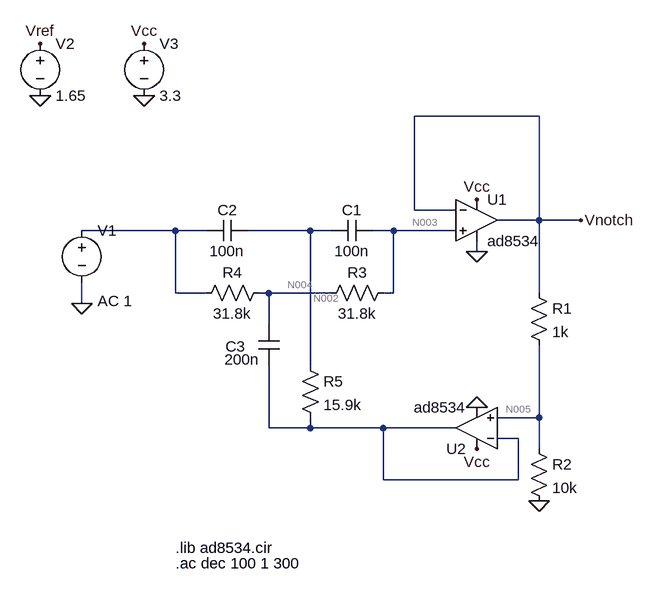
[diagram p0: schematic Draft1.asc]
Draft1.asc, the LTspice schematic file:
Version 4.1
SHEET 1 880 680
WIRE 512 -64 320 -64
WIRE 320 80 320 -64
WIRE 384 80 320 80
WIRE 512 96 512 -64
WIRE 512 96 448 96
WIRE 576 96 512 96
WIRE -48 112 -192 112
WIRE 0 112 -48 112
WIRE 160 112 64 112
WIRE 192 112 160 112
WIRE 288 112 256 112
WIRE 384 112 288 112
WIRE 416 144 416 128
WIRE -48 208 -48 112
WIRE 0 208 -48 208
WIRE 96 208 80 208
WIRE 192 208 96 208
WIRE 288 208 288 112
WIRE 288 208 272 208
WIRE 512 208 512 96
WIRE -192 224 -192 192
WIRE 96 256 96 208
WIRE 160 320 160 112
WIRE 512 400 512 288
WIRE 512 400 448 400
WIRE 96 416 96 320
WIRE 160 416 160 400
WIRE 160 416 96 416
WIRE 272 416 160 416
WIRE 384 416 272 416
WIRE 480 432 448 432
WIRE 512 448 512 400
WIRE 272 496 272 416
WIRE 480 496 480 432
WIRE 480 496 272 496
FLAG 416 144 0
FLAG 416 64 Vcc
FLAG 576 96 Vnotch
FLAG 416 448 Vcc
FLAG 416 384 0
FLAG -192 224 0
FLAG -256 -176 Vref
FLAG -256 -96 0
FLAG -96 -96 0
FLAG -96 -176 Vcc
FLAG 512 528 0
SYMBOL OpAmps\\opamp2 416 32 R0
SYMATTR InstName U1
SYMATTR Value ad8534
SYMBOL res 496 192 R0
SYMATTR InstName R1
SYMATTR Value 1k
SYMBOL res 496 432 R0
SYMATTR InstName R2
SYMATTR Value 10k
SYMBOL cap 256 96 R90
WINDOW 0 0 32 VBottom 2
WINDOW 3 32 32 VTop 2
SYMATTR InstName C1
SYMATTR Value 100n
SYMBOL cap 64 96 R90
WINDOW 0 0 32 VBottom 2
WINDOW 3 32 32 VTop 2
SYMATTR InstName C2
SYMATTR Value 100n
SYMBOL res 288 192 R90
WINDOW 0 0 56 VBottom 2
WINDOW 3 32 56 VTop 2
SYMATTR InstName R3
SYMATTR Value 31.8k
SYMBOL res 96 192 R90
WINDOW 0 0 56 VBottom 2
WINDOW 3 32 56 VTop 2
SYMATTR InstName R4
SYMATTR Value 31.8k
SYMBOL cap 80 256 R0
WINDOW 0 -51 34 Left 2
WINDOW 3 -52 54 Left 2
SYMATTR InstName C3
SYMATTR Value 200n
SYMBOL res 144 304 R0
SYMATTR InstName R5
SYMATTR Value 15.9k
SYMBOL OpAmps\\opamp2 416 480 R180
SYMATTR InstName U2
SYMATTR Value ad8534
SYMBOL voltage -192 96 R0
WINDOW 123 24 124 Left 2
WINDOW 39 0 0 Left 0
SYMATTR InstName V1
SYMATTR Value ""
SYMATTR Value2 AC 1
SYMBOL voltage -256 -192 R0
WINDOW 123 0 0 Left 0
WINDOW 39 0 0 Left 0
SYMATTR InstName V2
SYMATTR Value 1.65
SYMBOL voltage -96 -192 R0
SYMATTR InstName V3
SYMATTR Value 3.3
TEXT -48 624 Left 2 !.ac dec 100 1 300
TEXT -48 600 Left 2 !.lib ad8534.cir

The netlist it stands for:
* Draft1.asc
X§U1 N003 Vnotch Vcc 0 Vnotch ad8534  ; pins In+ In- V+ V- OUT
R1 Vnotch N005 1k
R2 N005 0 10k
C1 N003 N002 100n
C2 N002 N001 100n
R3 N003 N004 31.8k
R4 N004 N001 31.8k
C3 N004 N006 200n
R5 N002 N006 15.9k
X§U2 N005 N006 Vcc 0 N006 ad8534  ; pins In+ In- V+ V- OUT
V1 N001 0 AC 1
V2 Vref 0 1.65
V3 Vcc 0 3.3
.ac dec 100 1 300
.lib ad8534.cir
.backanno
.end

* Results of the author's LTspice run, read from the files saved beside the schematic
* Operating Point, zero values left out:
*   V(n003) = -286.2 nV
*   V(n004) = -143.1 nV
*   V(n005) = -4.112 nV
*   V(vcc) = 3.3 V
*   V(vref) = 1.65 V
*   I(R1) = 4.089 pA
*   I(R3) = -4.5 pA
*   I(R4) = -4.5 pA
*   I(V1) = -4.5 pA
*   I(V3) = -773.4 µA
*   Ix(u1:1) = 4.5 pA
*   Ix(u1:2) = 5.5 pA
*   Ix(u1:40) = -9.589 pA
*   Ix(u1:50) = -387 µA
*   Ix(u1:99) = 386.7 µA
*   Ix(u2:1) = 4.5 pA
*   Ix(u2:2) = 5.5 pA
*   Ix(u2:40) = -5.5 pA
*   Ix(u2:50) = -387 µA
*   Ix(u2:99) = 386.7 µA
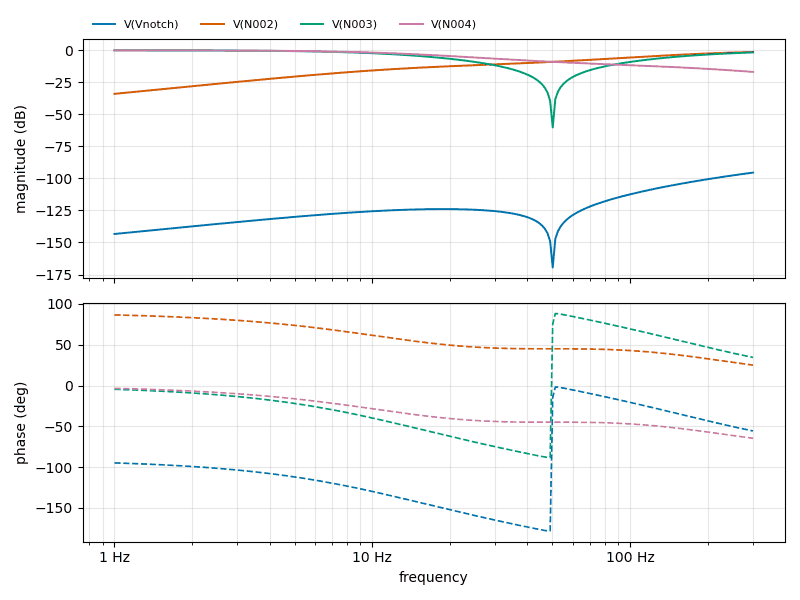
[diagram p1: AC Analysis of Draft1.asc, plotted from the saved traces]
* AC Analysis, 1 run:
*   V(Vnotch): -143.36 dB at 1 Hz, -95.46 dB at 300 Hz, peak -95.46 dB at 300 Hz, 3 dB below the peak at 234.6 Hz
*   V(N002): -34.00 dB at 1 Hz, -1.31 dB at 300 Hz, peak -1.31 dB at 300 Hz, 3 dB below the peak at 129.6 Hz
*   V(N003): -0.03 dB at 1 Hz, -1.67 dB at 300 Hz, peak -0.03 dB at 1 Hz, 3 dB below the peak at 11.88 Hz
*   V(N004): -0.02 dB at 1 Hz, -16.87 dB at 300 Hz, peak -0.02 dB at 1 Hz, 3 dB below the peak at 14.47 Hz